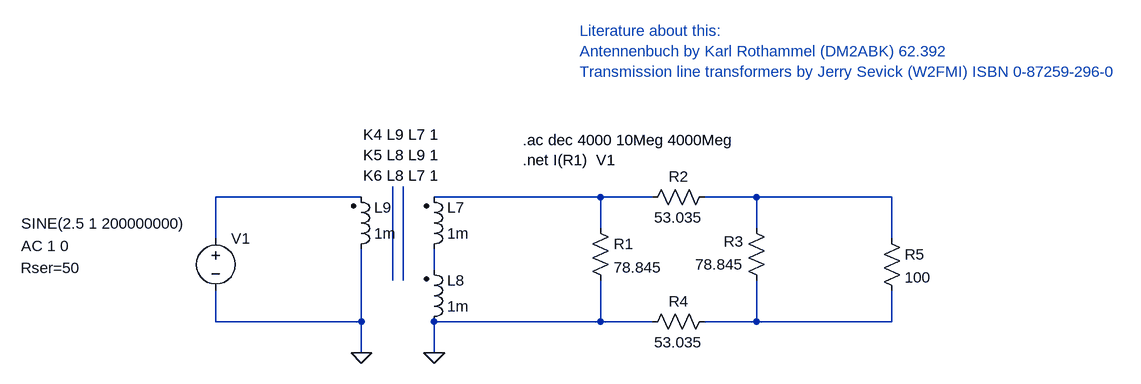
[diagram p0: schematic O_PAD.asc]
O_PAD.asc, the LTspice schematic file:
Version 4
SHEET 1 1860 820
WIRE -624 112 -848 112
WIRE -256 112 -512 112
WIRE -176 112 -256 112
WIRE -16 112 -96 112
WIRE 192 112 -16 112
WIRE -256 160 -256 112
WIRE -16 160 -16 112
WIRE -848 176 -848 112
WIRE 192 176 192 112
WIRE -512 224 -512 192
WIRE -576 240 -576 96
WIRE -560 240 -560 96
WIRE -848 304 -848 256
WIRE -624 304 -624 192
WIRE -624 304 -848 304
WIRE -256 304 -256 240
WIRE -256 304 -512 304
WIRE -176 304 -256 304
WIRE -16 304 -16 240
WIRE -16 304 -96 304
WIRE 192 304 192 256
WIRE 192 304 -16 304
WIRE -624 352 -624 304
WIRE -512 352 -512 304
FLAG -512 352 0
FLAG -624 352 0
SYMBOL res -272 144 R0
SYMATTR InstName R1
SYMATTR Value 78.845
SYMBOL res -80 96 R90
WINDOW 0 0 56 VBottom 2
WINDOW 3 32 56 VTop 2
SYMATTR InstName R2
SYMATTR Value 53.035
SYMBOL res 0 256 R180
WINDOW 0 36 76 Left 2
WINDOW 3 36 40 Left 2
SYMATTR InstName R3
SYMATTR Value 78.845
SYMBOL res -80 288 R90
WINDOW 0 0 56 VBottom 2
WINDOW 3 32 56 VTop 2
SYMATTR InstName R4
SYMATTR Value 53.035
SYMBOL voltage -848 160 R0
WINDOW 123 -299 27 Left 2
WINDOW 39 -300 61 Left 2
WINDOW 3 -299 -7 Left 2
SYMATTR Value2 AC 1 0
SYMATTR SpiceLine Rser=50
SYMATTR Value SINE(2.5 1 200000000)
SYMATTR InstName V1
SYMBOL ind2 -528 208 M180
WINDOW 0 36 80 Left 2
WINDOW 3 36 40 Left 2
SYMATTR InstName L7
SYMATTR Value 1m
SYMBOL ind2 -528 320 M180
WINDOW 0 36 80 Left 2
WINDOW 3 36 40 Left 2
SYMATTR InstName L8
SYMATTR Value 1m
SYMBOL ind2 -640 208 M180
WINDOW 0 36 80 Left 2
WINDOW 3 36 40 Left 2
SYMATTR InstName L9
SYMATTR Value 1m
SYMBOL res 176 160 R0
SYMATTR InstName R5
SYMATTR Value 100
TEXT -376 24 Left 2 !.ac dec 4000 10Meg 4000Meg\n.net I(R1)  V1
TEXT -288 -144 Left 2 ;Literature about this:\nAntennenbuch by Karl Rothammel (DM2ABK) 62.392\nTransmission line transformers by Jerry Sevick (W2FMI) ISBN 0-87259-296-0
TEXT -504 16 Right 2 !K4 L9 L7 1\nK5 L8 L9 1\nK6 L8 L7 1

The netlist it stands for:
* O_PAD.asc
R1 N002 0 78.845
R2 N003 N002 53.035
R3 N007 N003 78.845
R4 N007 0 53.035
V1 N001 0 SINE(2.5 1 200000000) AC 1 0 Rser=50
L7 N004 N002 1m
L8 0 N004 1m
L9 0 N001 1m
R5 N003 N007 100
.ac dec 4000 10Meg 4000Meg
.net I(R1)  V1
* Literature about this:
* Antennenbuch by Karl Rothammel (DM2ABK) 62.392
* Transmission line transformers by Jerry Sevick (W2FMI) ISBN 0-87259-296-0
K4 L9 L7 1
K5 L8 L9 1
K6 L8 L7 1
.backanno
.end